# EAGLE design brightness_control (EAGLE 9.6.1)
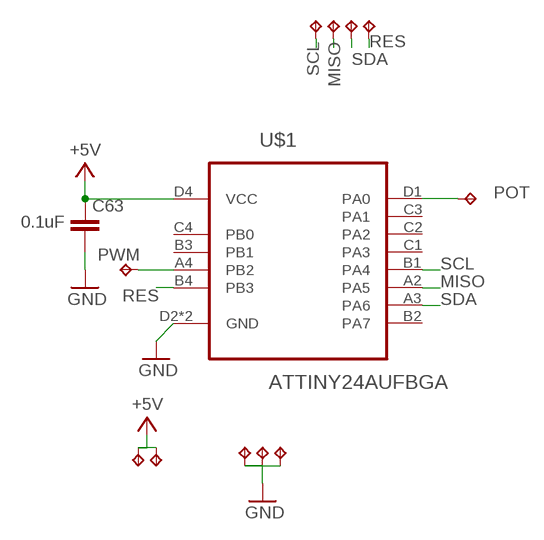
[diagram p0: schematic, sheet 1]

## Parts
C63  0.1uF  C-USC0402  [C0402]
TP1  TPTP12R  [TP12R]
TP3  TPTP12R  [TP12R]
TP4  TPTP12R  [TP12R]
TP5  TPTP12R  [TP12R]
TP6  TPTP12R  [TP12R]
TP7  TPTP12R  [TP12R]
TP8  TPTP12R  [TP12R]
TP10  TPTP12R  [TP12R]
TP11  TPTP12R  [TP12R]
TP12  TPTP12R  [TP12R]
TP13  TPTP12R  [TP12R]
U$1  ATTINY24AUFBGA  [UFBGA-15]

## Nets
+5V: C63.1 TP3.TP TP4.TP U$1.D4(VCC)
GND: C63.2 TP1.TP TP5.TP TP6.TP U$1.D2(GND) U$1.D3(GND)
MISO: TP11.TP U$1.A2(PA5)
POT: TP7.TP U$1.D1(PA0)
PWM: TP8.TP U$1.A4(PB2)
RES: TP13.TP U$1.B4(PB3)
SCL: TP10.TP U$1.B1(PA4)
SDA: TP12.TP U$1.A3(PA6)
Unconnected: U$1.B2(PA7) U$1.B3(PB1) U$1.C1(PA3) U$1.C2(PA2) U$1.C3(PA1) U$1.C4(PB0)

## Library data of the parts
C63 = resistor:C-US: CAPACITOR, American symbol
TP1 TP3-TP8 TP10-TP13 = testpad:TP: Test pad
U$1 = personal:ATTINY24A

## Board
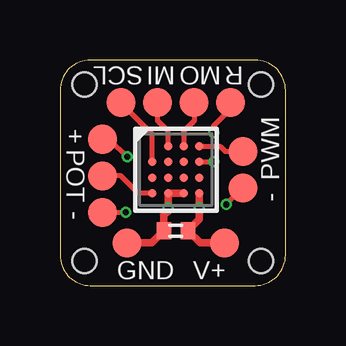
[diagram p1: board, top side]
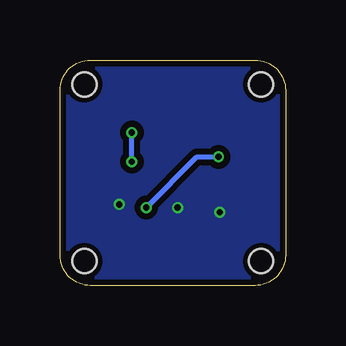
[diagram p2: board, bottom side, seen from below]

Size 9.4 x 9.4 mm. Coordinates in mm from the lower left corner, seen from the top.
Outline: 8.13,9.4 1.27,9.4 arc90 0,8.13 0,1.27 arc90 1.27,0 8.13,0 arc90 9.4,1.27 9.4,8.13 arc90 8.13,9.4
Copper layers (1*16): Top 0.035mm / dielectric 0.73mm / Bottom 0.035mm
Design rules "default *": minimum track width 6mil, minimum drill 8mil, track to track 6mil, track to pad 6mil, pad to pad 6mil, via to via 6mil, smd to smd 6mil, copper to edge 6mil, drill to drill 6mil, minimum pad ring 4mil, minimum via ring 4mil, stop-mask expansion 0mil, vias tented up to drill 50mil, thermal gap 10mil
Holes 1 mm at 1.02,1.02 8.38,1.02 1.02,8.38 8.38,8.38

### Footprints (pad centres in the part's own frame; a part is rotated, then mirrored left to right if it is on the bottom)
C0402 = smd 0.6 x 0.7: 1 -0.5,0; 2 0.5,0
TP12R = smd 1.2 x 1.2: TP 0,0
UFBGA-15 = smd 0.35 x 0.35: A2 -0.325,0.975; A3 0.325,0.975; A4 0.975,0.975; B1 -0.975,0.325; B2 -0.325,0.325; B3 0.325,0.325; B4 0.975,0.325; C1 -0.975,-0.325; C2 -0.325,-0.325; C3 0.325,-0.325; C4 0.975,-0.325; D1 -0.975,-0.975; D2 -0.325,-0.975; D3 0.325,-0.975; D4 0.975,-0.975

### Placement (x,y rotation side)
C63  4.83,2.29 180 top
TP1  2.79,1.78 0 top
TP3  6.86,1.78 0 top
TP4  1.78,6.1 0 top
TP5  7.62,4.06 0 top
TP6  1.78,3.05 0 top
TP7  1.78,4.57 0 top
TP8  7.62,5.59 0 top
TP10  2.54,7.62 0 top
TP11  4.06,7.62 0 top
TP12  5.59,7.62 0 top
TP13  7.11,7.62 0 top
U$1  4.83,4.83 0 top

### Tracks (layer width: path | path; a pad name or v marks a point on that pad's centre or on a via)
+5V  (via drill 0.25 pad 0.46)
  Top 0.203: TP4.TP 2.06,6.1 v2.79,5.36
  Top 0.305: U$1.D4 v5.8,3.25 5.8,2.76 C63.1 5.83,1.78 TP3.TP
  Bottom 0.203: v5.8,3.25 3.69,5.36 v2.79,5.36
GND  (via drill 0.25 pad 0.46)
  Top 0.203: TP6.TP v2.74,3.05 | TP5.TP v6.93,3.38
  Top 0.305: TP1.TP 3.82,1.78 C63.2 4.33,2.92 4.5,3.1 v4.5,3.25 U$1.D2 U$1.D3 | 1.78,2.79 TP6.TP
  pour Bottom (isolate 0.254): 0,9.4 0,0 9.4,0 9.4,9.4
MISO
  Top 0.203: U$1.A2 4.5,6.42 4.06,6.86 TP11.TP
POT
  Top 0.203: U$1.D1 3.26,3.85 2.54,4.57 TP7.TP
PWM
  Top 0.203: U$1.A4 6.67,5.8 6.88,5.59 TP8.TP
RES  (via drill 0.25 pad 0.46)
  Top 0.203: v6.4,6.38 6.4,6.65 7.11,7.37 TP13.TP | U$1.B4 v6.4,5.16
  Bottom 0.203: v6.4,5.16 v6.4,6.38
SCL
  Top 0.203: U$1.B1 3.85,6.31 TP10.TP
SDA
  Top 0.203: TP12.TP 5.59,6.86 5.15,6.42 U$1.A3

### Text on the board
tPlace: SCL | MI | MO | R | + | PWM | POT | - | - | GND | V+